# EAGLE design adc_microboard (EAGLE 6.3)

## Sheet 1 of 2
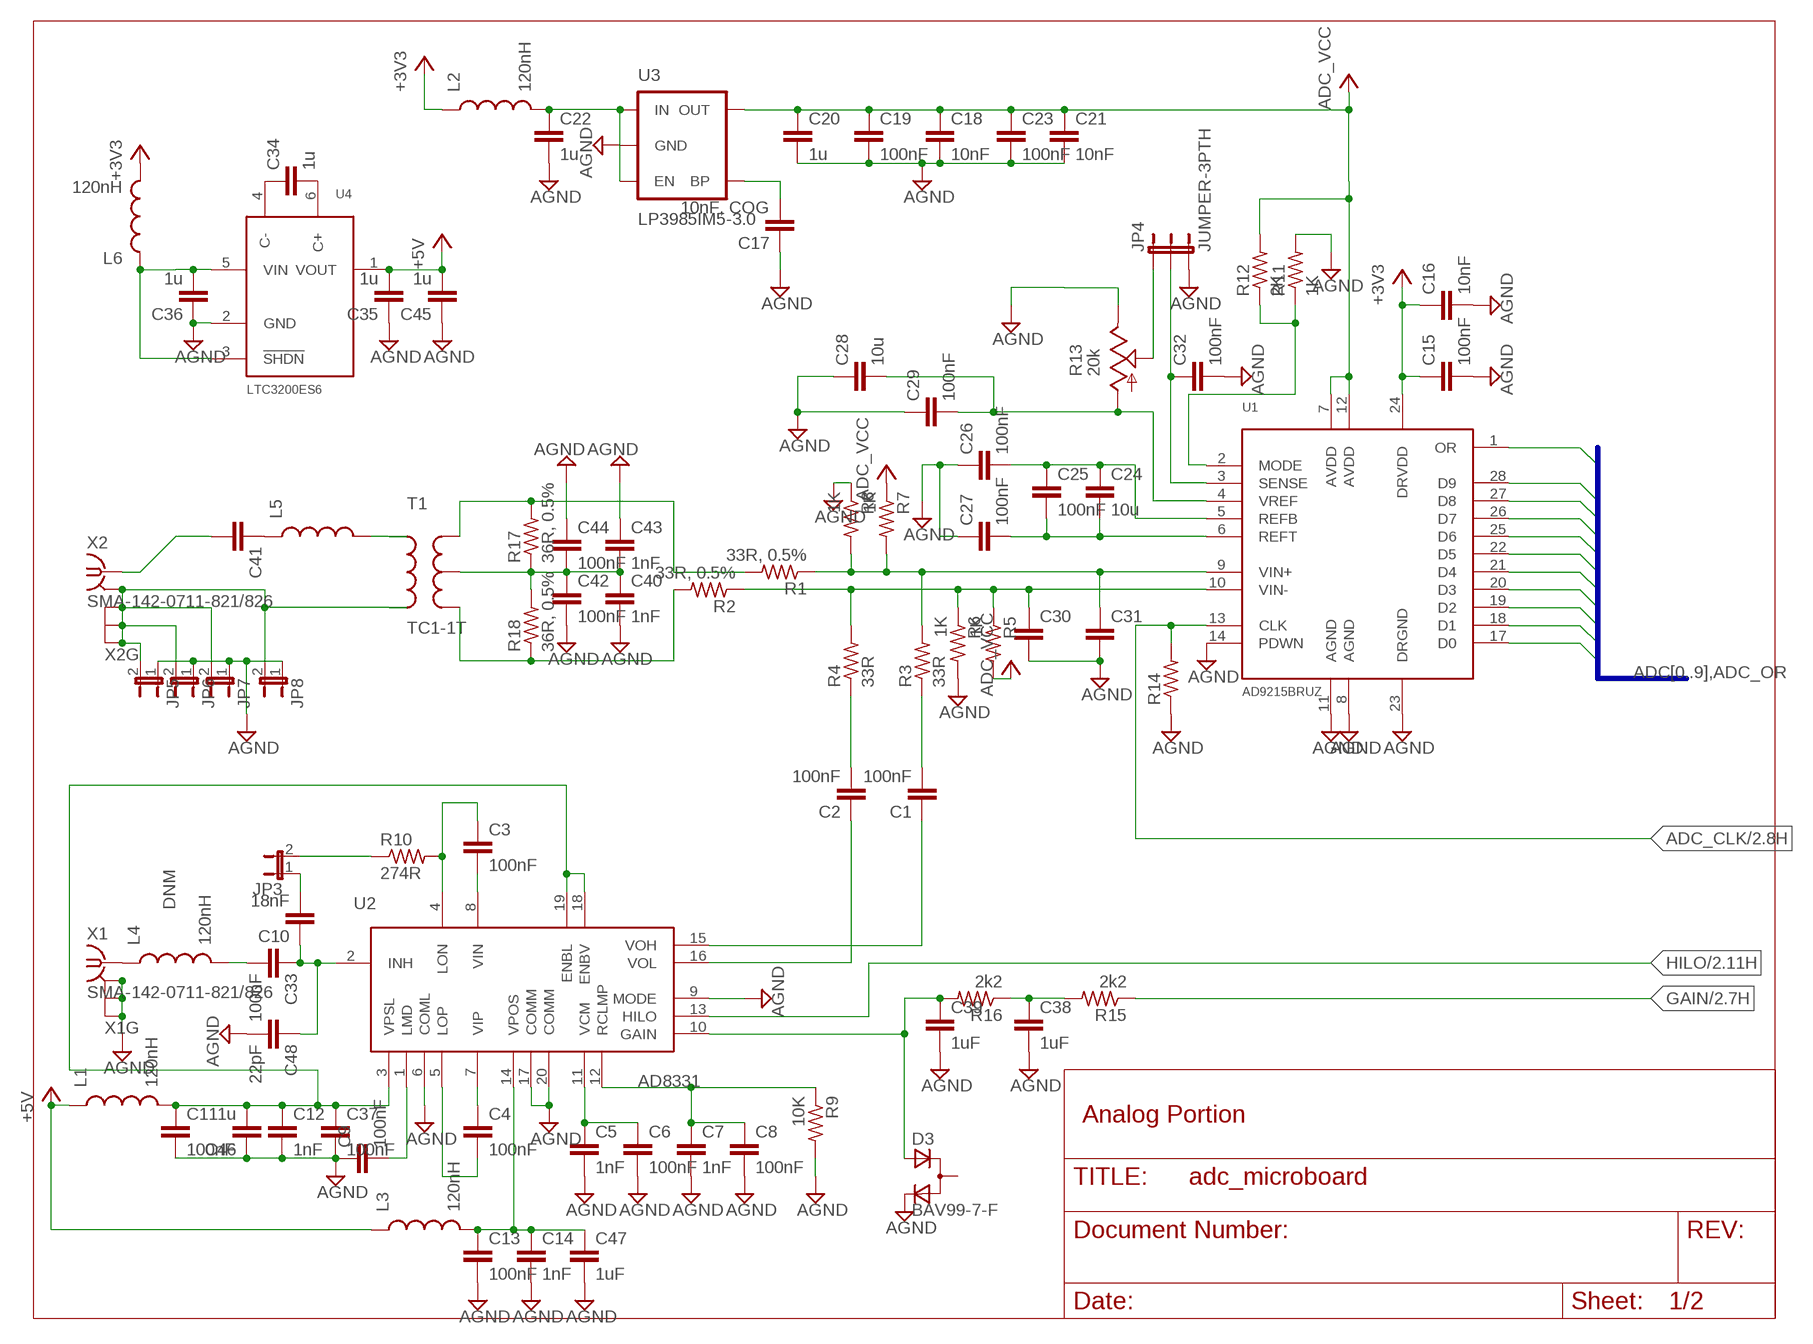
[diagram p0: schematic, sheet 1]

### Parts
C1  100nF  C-EUC0603K  [C0603K]
C2  100nF  C-EUC0603K  [C0603K]
C3  100nF  C-EUC0402  [C0402]
C4  100nF  C-EUC0402  [C0402]
C5  1nF  C-EUC0402  [C0402]
C6  100nF  C-EUC0402  [C0402]
C7  1nF  C-EUC0402  [C0402]
C8  100nF  C-EUC0402  [C0402]
C9  100nF  C-EUC0402  [C0402]
C10  18nF  C-EUC0603  [C0603]
C11  100nF  C-EUC0402  [C0402]
C12  1nF  C-EUC0402  [C0402]
C13  100nF  C-EUC0402  [C0402]
C14  1nF  C-EUC0402  [C0402]
C15  100nF  C-EUC0402  [C0402]
C16  10nF  C-EUC0402  [C0402]
C17  10nF, COG  C-EUC0402  [C0402]
C18  10nF  C-EUC0402  [C0402]
C19  100nF  C-EUC0402  [C0402]
C20  1u  C-EUC0603  [C0603]
C21  10nF  C-EUC0402  [C0402]
C22  1u  C-EUC0603  [C0603]
C23  100nF  C-EUC0402  [C0402]
C24  10u  C-EUC0603  [C0603]
C25  100nF  C-EUC0402  [C0402]
C26  100nF  C-EUC0402  [C0402]
C27  100nF  C-EUC0402  [C0402]
C28  10u  C-EUC0603  [C0603]
C29  100nF  C-EUC0402  [C0402]
C30  C-EUC0402  [C0402]
C31  C-EUC0402  [C0402]
C32  100nF  C-EUC0402  [C0402]
C33  100nF  C-EUC0603K  [C0603K]
C34  1u  C-EUC0603  [C0603]
C35  1u  C-EUC0603  [C0603]
C36  1u  C-EUC0603  [C0603]
C37  100nF  C-EUC0402  [C0402]
C38  1uF  C-EUC0603  [C0603]
C39  1uF  C-EUC0603  [C0603]
C40  1nF  C-EUC0402  [C0402]
C41  C-EUC0603K  [C0603K]
C42  100nF  C-EUC0402  [C0402]
C43  1nF  C-EUC0402  [C0402]
C44  100nF  C-EUC0402  [C0402]
C45  1u  C-EUC0603  [C0603]
C46  1u  C-EUC0402  [C0402]
C47  1uF  C-EUC0402  [C0402]
C48  22pF  C-EUC0603  [C0603]
D3  BAV99-7-F  D_ACACSOT23  [SOT-23]
JP3  JUMPER-2SMD-NC  [SJ_2S]
JP4  JUMPER-3PTH  [1X03]
JP5  JUMPER-2SMD-NC  [SJ_2S]
JP6  JUMPER-2SMD-NC  [SJ_2S]
JP7  JUMPER-2SMD-NC  [SJ_2S]
JP8  JUMPER-2SMD-NC  [SJ_2S]
L1  120nH  INDUCTOR0603  [0603]
L2  120nH  INDUCTOR0603  [0603]
L3  120nH  INDUCTOR0603  [0603]
L4  120nH  INDUCTOR0603  [0603]
L5  INDUCTOR0603  [0603]
L6  120nH  INDUCTOR0603  [0603]
R1  33R, 0.5%  R-US_R0603  [R0603]
R2  33R, 0.5%  R-US_R0603  [R0603]
R3  33R  R-US_R0603  [R0603]
R4  33R  R-US_R0603  [R0603]
R5  1K  R-US_R0402  [R0402]
R6  1K  R-US_R0402  [R0402]
R7  1K  R-US_R0402  [R0402]
R8  1K  R-US_R0402  [R0402]
R9  10K  R-US_R0603  [R0603]
R10  274R  R-US_R0603  [R0603]
R11  1K  R-US_R0402  [R0402]
R12  2K  R-US_R0603  [R0603]
R13  20k  TRIM_US-3361P  [3361P]
R14  R-US_R0603  [R0603]
R15  2k2  R-US_R0603  [R0603]
R16  2k2  R-US_R0603  [R0603]
R17  36R, 0.5%  R-US_R0603  [R0603]
R18  36R, 0.5%  R-US_R0603  [R0603]
T1  TC1-1T  [AT224-1A]
U1  AD9215BRUZ  [TSSOP28]
U2  AD8331  [QSOP20]
U3  LP3985IM5-3.0  V_REG_LDOSMD  [SOT23-5]
U4  LTC3200ES6  [SOT23-6L]
X1  SMA-142-0711-821/826  [J502-ND-142-0711-821/826]
X2  SMA-142-0711-821/826  [J502-ND-142-0711-821/826]

### Nets
+3V3: C15.1 C16.1 L2.1 L6.2 U1.24(DRVDD) ; also sheet 2
+5V: C35.2 C45.2 L1.1 L3.1 U4.1(VOUT)
ADC0: U1.17(D0) ; also sheet 2
ADC1: U1.18(D1) ; also sheet 2
ADC2: U1.19(D2) ; also sheet 2
ADC3: U1.20(D3) ; also sheet 2
ADC4: U1.21(D4) ; also sheet 2
ADC5: U1.22(D5) ; also sheet 2
ADC6: U1.25(D6) ; also sheet 2
ADC7: U1.26(D7) ; also sheet 2
ADC8: U1.27(D8) ; also sheet 2
ADC9: U1.28(D9) ; also sheet 2
ADC_CLK: R14.2 U1.13(CLK) ; also sheet 2
ADC_OR: U1.1(OR) ; also sheet 2
ADC_VCC: C18.1 C19.1 C20.1 C21.1 C23.1 R5.2 R7.1 R12.2 U1.7(AVDD) U1.12(AVDD) U3.5(OUT)
AGND: C5.2 C6.2 C7.2 C8.2 C9.1 C11.2 C12.2 C13.2 C14.2 C15.2 C16.2 C17.1 C18.2 C19.2 C20.2 C21.2 C22.2 C23.2 C26.1 C27.1 C28.1 C29.1 C30.2 C31.2 C32.2 C35.1 C36.1 C37.2 C38.2 C39.2 C40.2 C42.2 C43.1 C44.1 C45.1 C46.1 C47.2 C48.2 D3.2(C) JP4.3 JP5.1 JP6.1 JP7.1 JP8.1 R6.2 R8.1 R9.2 R11.2 R13.1(E) R14.1 U1.8(AGND) U1.11(AGND) U1.14(PDWN) U1.23(DRGND) U2.6(COML) U2.9(MODE) U2.17(COMM) U2.20(COMM) U3.2(GND) U4.2(GND) X1.G@1(GND) X1.G@2(GND) X1.G@3(GND) X1.G@4(GND) ; also sheet 2
GAIN: R15.1 ; also sheet 2
HILO: U2.13(HILO) ; also sheet 2
N$1: C31.1 R1.1 R3.2 R7.2 R8.2 U1.9(VIN+)
N$2: JP4.1 R13.2(S)
N$3: C1.2 R3.1
N$4: C2.2 R4.1
N$5: C4.2 U2.5(LOP)
N$6: C2.1 U2.16(VOL)
N$7: C1.1 U2.15(VOH)
N$8: C4.1 U2.7(VIP)
N$9: C3.2 U2.8(VIN)
N$10: C3.1 R10.2 U2.4(LON)
N$11: C5.1 C6.1 U2.11(VCM)
N$12: C7.1 C8.1 R9.1 U2.12(RCLMP)
N$13: C9.2 U2.1(LMD)
N$14: C10.2 JP3.1
N$15: JP3.2 R10.1
N$16: C10.1 C33.1 C48.1 U2.2(INH)
N$17: C17.2 U3.4(BP)
N$19: L4.1 X1.1
N$20: C13.1 C14.1 C47.1 L3.2 U2.14(VPOS)
N$21: C22.1 L2.2 U3.1(IN) U3.3(EN)
N$23: C24.1 C25.1 C26.2 U1.5(REFB)
N$24: C41.1 L5.1
N$25: C24.2 C25.2 C27.2 U1.6(REFT)
N$26: C30.1 R2.1 R4.2 R5.1 R6.1 U1.10(VIN-)
N$27: C28.2 C29.2 R13.3(A) U1.4(VREF)
N$28: C32.1 JP4.2 U1.3(SENSE)
N$29: R11.1 R12.1 U1.2(MODE)
N$30: L5.2 T1.6(P1)
N$31: JP5.2 JP6.2 JP7.2 JP8.2 T1.4(P2) X2.G@1(GND) X2.G@2(GND) X2.G@3(GND) X2.G@4(GND)
N$32: R1.2 R17.2 T1.1(S1)
N$33: C34.1 U4.4(C-)
N$34: C34.2 U4.6(C+)
N$35: C11.1 C12.1 C37.1 C46.2 L1.2 U2.3(VPSL) U2.18(ENBV) U2.19(ENBL)
N$36: C38.1 R15.2 R16.1
N$37: C39.1 D3.3(A) R16.2 U2.10(GAIN)
N$38: R2.2 R18.1 T1.3(S2)
N$39: C40.1 C42.1 C43.2 C44.2 R17.1 R18.2 T1.2(ST)
N$43: C41.2 X2.1
N$45: C36.2 L6.1 U4.3(!SHDN) U4.5(VIN)
N$46: C33.2 L4.2
Unconnected: D3.1(CA)

### Buses
ADC[0..9],ADC_OR

### Notes on the sheet
- DNM
- Analog Portion

## Sheet 2 of 2
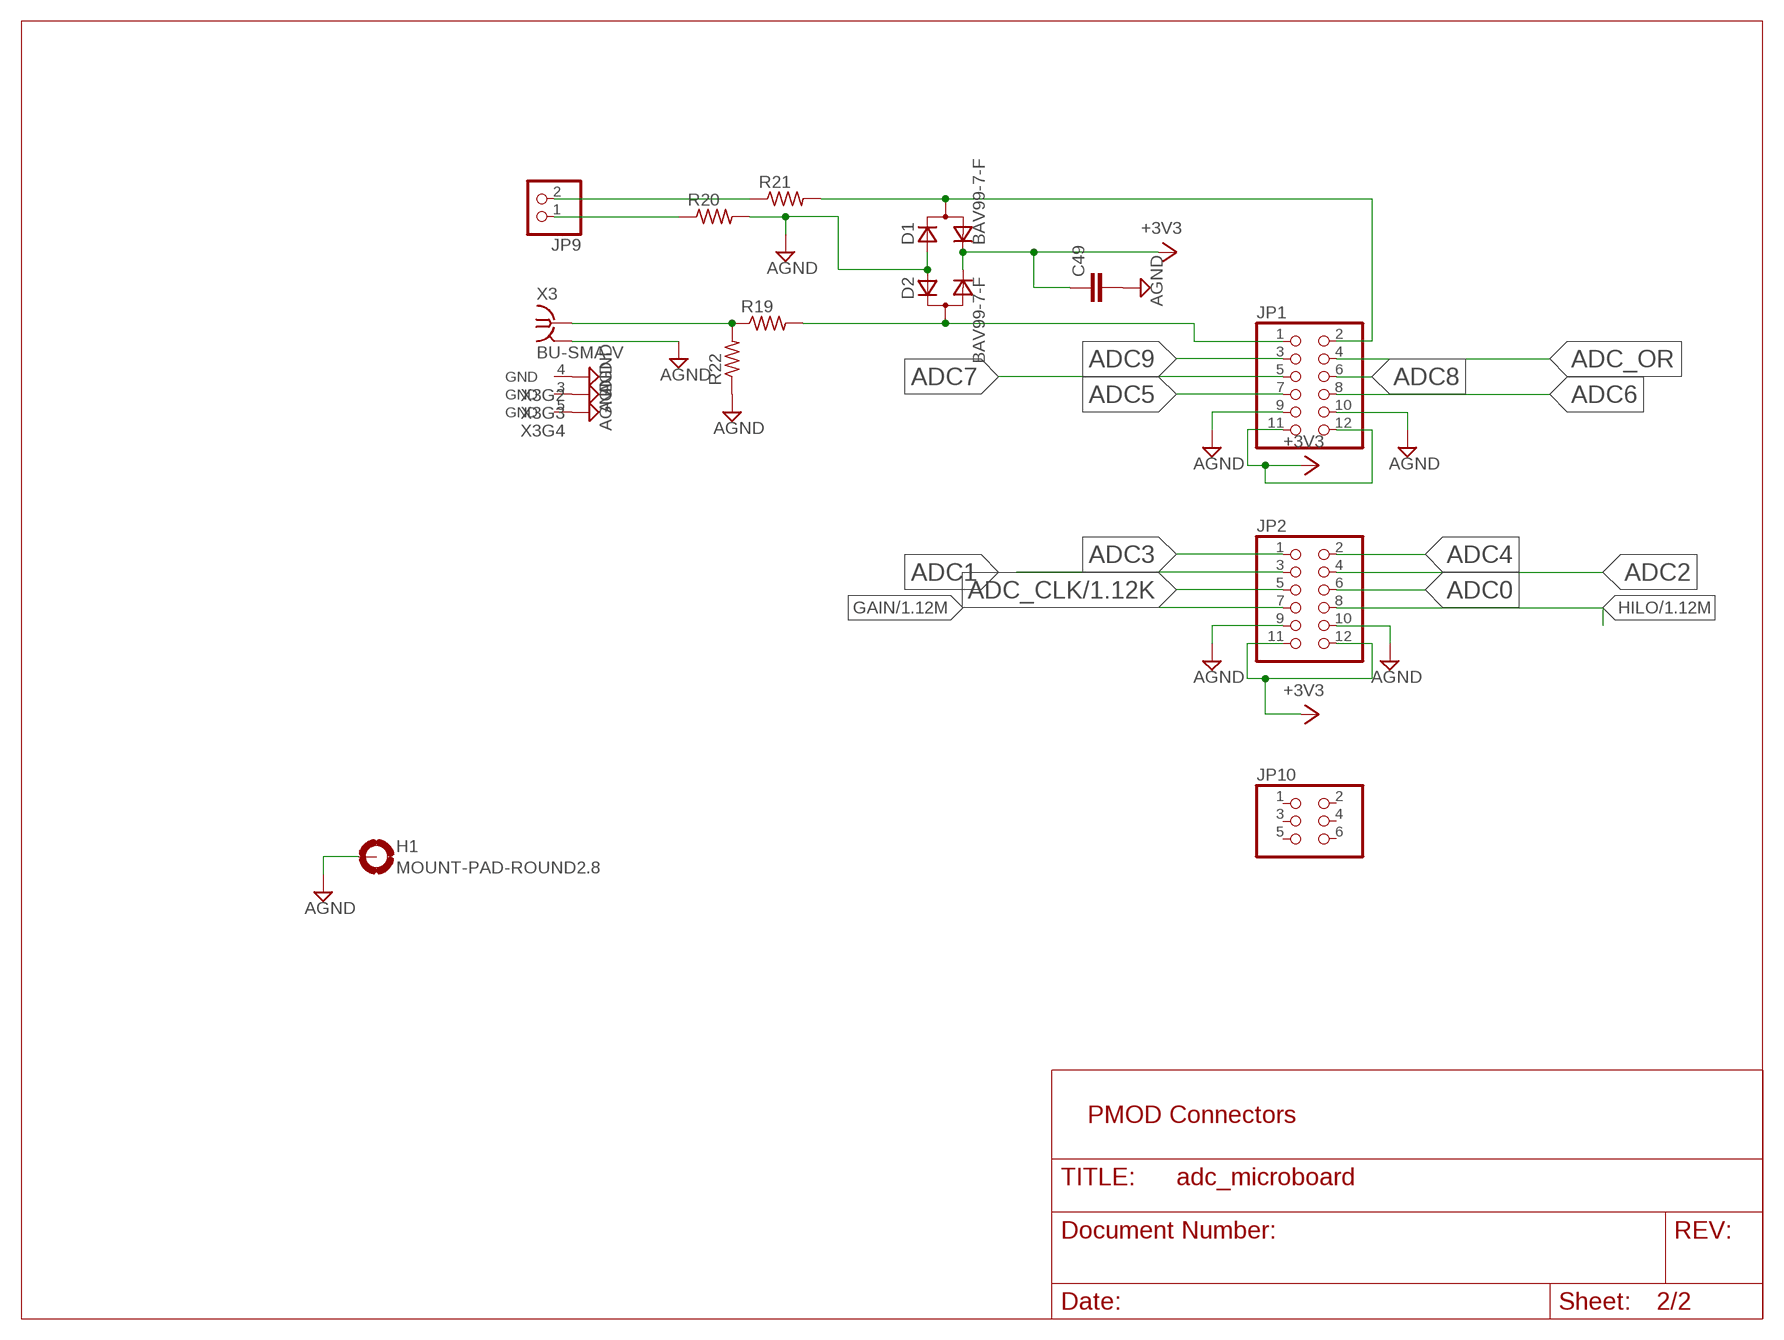
[diagram p1: schematic, sheet 2]

### Parts
C49  C-EUC0603  [C0603]
D1  BAV99-7-F  D_ACACSOT23  [SOT-23]
D2  BAV99-7-F  D_ACACSOT23  [SOT-23]
H1  MOUNT-PAD-ROUND2.8  [2,8-PAD]
JP1  PINHD-2X6  [2X06]
JP2  PINHD-2X6  [2X06]
JP9  PINHD-1X2/90  [1X02/90]
JP10  PINHD-2X3  [2X03]
R19  R-US_R0805  [R0805]
R20  R-US_R0603  [R0603]
R21  R-US_R0603  [R0603]
R22  R-US_R0603  [R0603]
X3  BU-SMA-V  [BU-SMA-V]

### Nets
+3V3: C49.1 D1.2(C) D2.2(C) JP1.11 JP1.12 JP2.11 JP2.12 ; also sheet 1
ADC0: JP2.6 ; also sheet 1
ADC1: JP2.3 ; also sheet 1
ADC2: JP2.4 ; also sheet 1
ADC3: JP2.1 ; also sheet 1
ADC4: JP2.2 ; also sheet 1
ADC5: JP1.7 ; also sheet 1
ADC6: JP1.8 ; also sheet 1
ADC7: JP1.5 ; also sheet 1
ADC8: JP1.6 ; also sheet 1
ADC9: JP1.3 ; also sheet 1
ADC_CLK: JP2.5 ; also sheet 1
ADC_OR: JP1.4 ; also sheet 1
AGND: C49.2 D1.3(A) D2.3(A) H1.B2,8(MOUNT) JP1.9 JP1.10 JP2.9 JP2.10 R20.2 R22.1 X3.2(GND) X3.3(GND) X3.4(GND) X3.5(GND) ; also sheet 1
GAIN: JP2.7 ; also sheet 1
HILO: JP2.8 ; also sheet 1
N$18: D2.1(CA) JP1.1 R19.2
N$40: R19.1 R22.2 X3.1
N$41: JP9.1 R20.1
N$42: JP9.2 R21.1
N$44: D1.1(CA) JP1.2 R21.2
Unconnected: JP10.1 JP10.2 JP10.3 JP10.4 JP10.5 JP10.6

### Notes on the sheet
- PMOD Connectors

## Library data of the parts
C1-C4 C28 C30 C31 C33 C38 C39 C41 = rcl:C-EU: CAPACITOR, European symbol
C5 C7 C12 C14 C40 C43 C47 = rcl:C-EU: CAPACITOR, European symbol; DIGIKEY#: 445-4924-1-ND; PART#: C1005X7R1E102K
C6 C8 C9 C11 C13 C15 C19 C23 C25-C27 C29 C32 C37 C42 C44 = rcl:C-EU: CAPACITOR, European symbol; DIGIKEY#: 490-1318-1-ND; PART#: GRM155R61A104KA01D
C10 C48 = rcl:C-EU: CAPACITOR, European symbol; DIGIKEY#: 587-1099-1-ND; MANF#: LMK107SD183JA-T
C16 = rcl:C-EU: CAPACITOR, European symbol; DIGIKEY#: 490-1312-1-ND; MANF#: GRM155R71E103KA01D
C17 = rcl:C-EU: CAPACITOR, European symbol; DIGIKEY#: 445-2664-1-ND
C18 C21 = rcl:C-EU: CAPACITOR, European symbol; DIGIKEY#: 490-1312-1-ND; DIIGKEY#: 490-1312-1-ND; MANF#: GRM155R71E103KA01D; PART#: GRM155R71E103KA01D
C20 C22 C34-C36 C45 C46 = rcl:C-EU: CAPACITOR, European symbol; DIGIKEY#: 490-1543-1-ND; PART#: GRM188R61A105KA61D
C24 = rcl:C-EU: CAPACITOR, European symbol; DIGIKEY#: C1608X5R0J106K
C49 = adc_microboard:C-EU: CAPACITOR, European symbol
D1-D3 = zetex:D_ACAC: Dual DIODE; OC_FARNELL: unknown; OC_NEWARK: unknown
H1 = holes:MOUNT-PAD-ROUND: MOUNTING PAD, round
JP1 = pinhead:PINHD-2X6: PIN HEADER; DIGIKEY#: 609-3373-ND
JP2 = pinhead:PINHD-2X6: PIN HEADER
JP3 JP5-JP8 = SparkFun:JUMPER-2: Jumper Basic 0.1" spaced jumper. Use with breakaway headers.
JP4 = SparkFun:JUMPER-3
JP9 = pinhead:PINHD-1X2: PIN HEADER; DIGIKEY#: WM2711-ND
JP10 = pinhead:PINHD-2X3: PIN HEADER
L1 = SparkFun:INDUCTOR: Inductors Basic Inductor/Choke - 0603 and 1206. Footprints are not proven and vary greatly between part numbers.; DIGIKEY#: 445-6234-1-ND; PART#: MLF1608DR12M
L2-L6 = SparkFun:INDUCTOR: Inductors Basic Inductor/Choke - 0603 and 1206. Footprints are not proven and vary greatly between part numbers.
R1 = adafruit:R-US_: RESISTOR, American symbol; DIGIKEY#: RR08Q33DCT-ND
R2-R4 R6-R9 R11 R12 R14-R16 R19-R22 = adafruit:R-US_: RESISTOR, American symbol
R5 = adafruit:R-US_: RESISTOR, American symbol; DIGIKEY#: RHM1.00KCDCT-ND
R10 = adafruit:R-US_: RESISTOR, American symbol; DIGIKEY#: RR08P274DCT-ND
R13 = customs:TRIM_US-: POTENTIOMETER; DIGIKEY#: 3361P-203GLFCT-ND; PART#: 3361P-1-203GLF
R17 R18 = adafruit:R-US_: RESISTOR, American symbol; DIGIKEY#: RR08Q36DCT-ND
T1 = customs:TC1-1T
U1 = customs:AD9215BRUZ; DIGIKEY#: AD9215BRUZ-105-ND
U2 = customs:AD8331; DIGIKEY#: AD8331ARQZ-ND; PART#: AD8331ARQZ
U3 = SparkFun:V_REG_LDO: Voltage Regulator LDO Standard 150mA LDO voltage regulator in SOT-23 layout. Micrel part MIC5205. BP (by-pass) pin is used to lower output noise with 470pF cap.; DIGIKEY#: LP3985IM5-3.0CT-ND
U4 = customs:LTC3200; DIIGKEY#: LTC3200ES6-5#TRMPBFCT-ND; PART#: LTC3200ES6-5#TRMPBF
X1 X2 = con-coax:SMA-: SMA 50 Ohm End Launch Jack Receptacle - Round Contact Johnson Components Source: www.johnsoncomponents.com .. J502-ND.pdf; DIGIKEY#: CONSMA003.062-ND; MF: JOHNSON COMPONENTS; MPN: 142-0711-821; OC_FARNELL: 1019328; OC_NEWARK: 16F3627
X3 = con-coax:BU-SMA-V: FEMALE SMA CONNECTOR Radiall distributor RS 112-3794; OC_FARNELL: unknown; OC_NEWARK: unknown

## Board
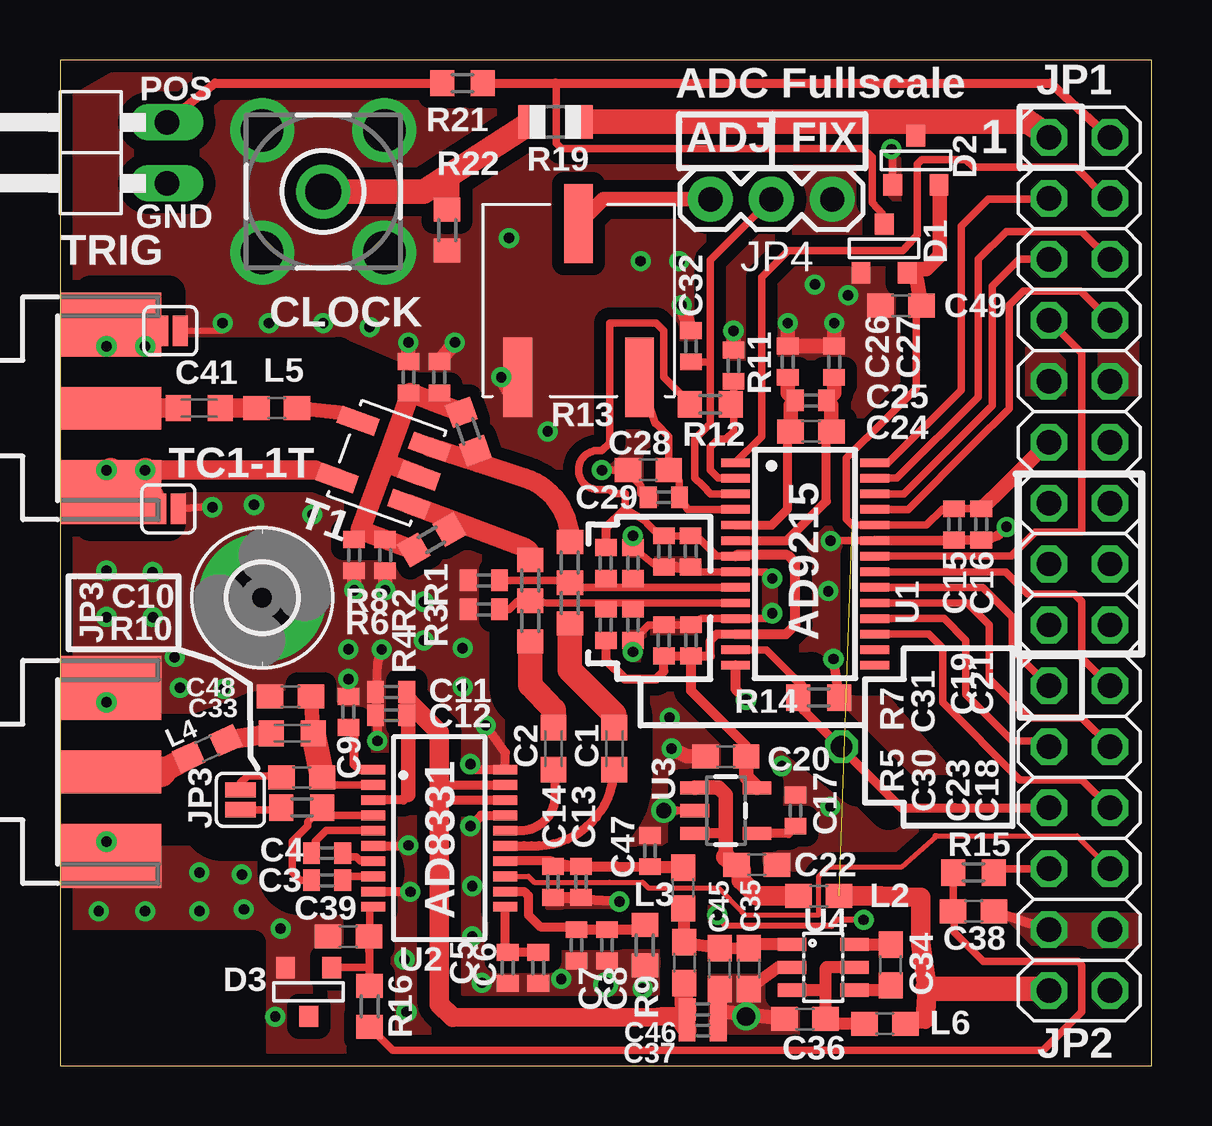
[diagram p2: board, top side]
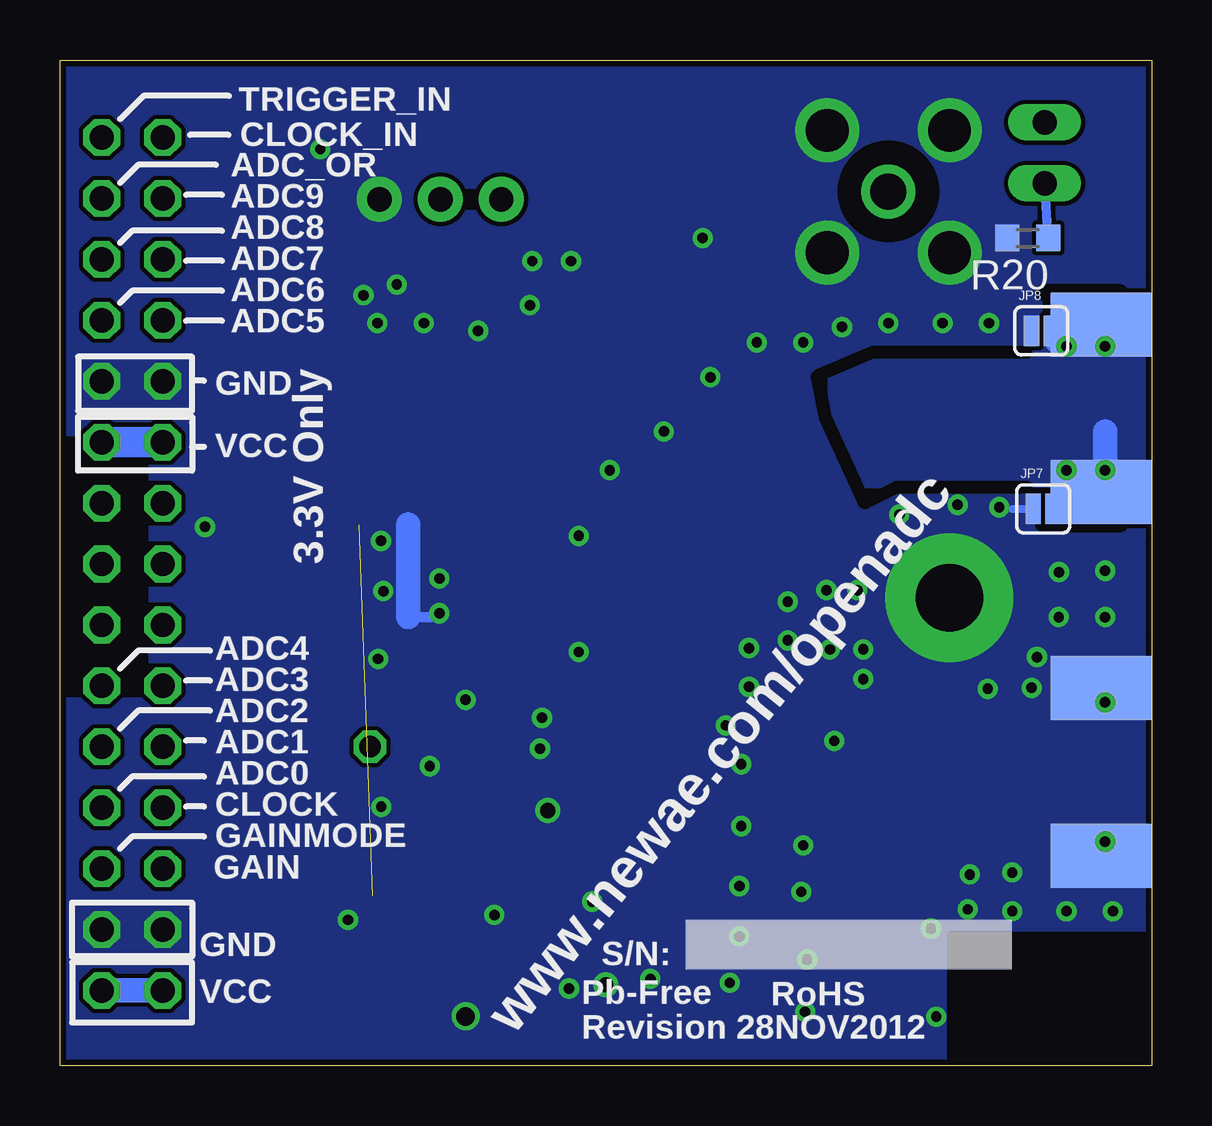
[diagram p3: board, bottom side, seen from below]

Size 45.48 x 41.94 mm. Coordinates in mm from the lower left corner, seen from the top.
Outline: 0,0 45.48,0 45.48,41.94 0,41.94 0,0
Copper layers (1*16): Top 0.035mm / dielectric 1.5mm / Bottom 0.035mm
Design rules "default": minimum track width 7mil, minimum drill 24mil, track to track 7mil, track to pad 7mil, pad to pad 7mil, via to via 7mil, smd to smd 0mil, copper to edge 10mil, drill to drill 8mil, minimum pad ring 10mil, minimum via ring 8mil, stop-mask expansion 4mil, vias tented up to drill 26mil, thermal gap 10mil
tRestrict: area -0.3,-0.6 to 8.1,5.2; 49 lines
bRestrict: area 10.2,35.7 to 11.7,37.2; area -0.3,-0.3 to 8.4,5.5; area 41.9,15.5 to 45.5,26.1; 8 lines

### Footprints (pad centres in the part's own frame; a part is rotated, then mirrored left to right if it is on the bottom)
C0603K = smd 1.05 x 1.08: 1 -0.875,0; 2 0.875,0
C0402 = smd 0.7 x 0.9: 1 -0.65,0; 2 0.65,0
C0603 = smd 1.1 x 1: 1 -0.85,0; 2 0.85,0
SOT-23 = smd 0.787 x 0.889: 1 0.025,-1.016; 2 -0.94,1.016; 3 0.991,1.016
2,8-PAD = drill 2.8 pad 5.334: B2,8 0,0
2X06 = drill 1.016 octagon: 1 -6.35,-1.27; 2 -6.35,1.27; 3 -3.81,-1.27; 4 -3.81,1.27; 5 -1.27,-1.27; 6 -1.27,1.27; 7 1.27,-1.27; 8 1.27,1.27; 9 3.81,-1.27; 10 3.81,1.27; 11 6.35,-1.27; 12 6.35,1.27
SJ_2S = smd 0.635 x 1.27: 1 -0.412,0; 2 0.412,0
1X03 = drill 1.016 pad 1.88: 1 0,0; 2 2.54,0; 3 5.08,0
1X02/90 = drill 1.016 long: 1 -1.27,-3.81; 2 1.27,-3.81
2X03 = drill 1.016 octagon: 1 -2.54,-1.27; 2 -2.54,1.27; 3 0,-1.27; 4 0,1.27; 5 2.54,-1.27; 6 2.54,1.27
0603 = smd 1.1 x 1: 1 -0.85,0; 2 0.85,0
R0603 = smd 1 x 1.1: 1 -0.85,0; 2 0.85,0
R0402 = smd 0.7 x 0.9: 1 -0.65,0; 2 0.65,0
3361P = smd 1.19 x 3.3: 1 -2.54,0; 2 0,6.4; 3 2.54,0
R0805 = smd 1.1 x 1.4: 1 -1,0; 2 1,0
AT224-1A = smd 0.762 x 1.651: 1 -1.27,2.54; 2 0,2.54; 3 1.27,2.54; 4 1.27,-0.635; 6 -1.27,-0.635
TSSOP28 = smd 0.35 x 1.2: 1 -4.225,-2.9; 2 -3.575,-2.9; 3 -2.925,-2.9; 4 -2.275,-2.9; 5 -1.625,-2.9; 6 -0.975,-2.9; 7 -0.325,-2.9; 8 0.325,-2.9; 9 0.975,-2.9; 10 1.625,-2.9; 11 2.275,-2.9; 12 2.925,-2.9; 13 3.575,-2.9; 14 4.225,-2.9; 15 4.225,2.9; 16 3.575,2.9; 17 2.925,2.9; 18 2.275,2.9; 19 1.625,2.9; 20 0.975,2.9; 21 0.325,2.9; 22 -0.325,2.9; 23 -0.975,2.9; 24 -1.625,2.9; 25 -2.275,2.9; 26 -2.925,2.9; 27 -3.575,2.9; 28 -4.225,2.9
QSOP20 = smd 0.4 x 1: 1 -2.858,-2.75; 2 -2.223,-2.75; 3 -1.588,-2.75; 4 -0.953,-2.75; 5 -0.318,-2.75; 6 0.318,-2.75; 7 0.953,-2.75; 8 1.588,-2.75; 9 2.223,-2.75; 10 2.858,-2.75; 11 2.858,2.75; 12 2.223,2.75; 13 1.588,2.75; 14 0.953,2.75; 15 0.318,2.75; 16 -0.318,2.75; 17 -0.953,2.75; 18 -1.588,2.75; 19 -2.223,2.75; 20 -2.858,2.75
SOT23-5 = smd 0.55 x 1.2: 1 -0.95,-1.3; 2 0,-1.3; 3 0.95,-1.3; 4 0.95,1.3; 5 -0.95,1.3
SOT23-6L = smd 0.55 x 1.2: 1 -0.95,-1.3; 2 0,-1.3; 3 0.95,-1.3; 4 0.95,1.3; 5 0,1.3; 6 -0.95,1.3
J502-ND-142-0711-821/826 = smd 4.191 x 1.778: 1 2.115,0 | smd 4.191 x 2.667: G@1 2.115,3.495; G@2 2.115,-3.495 | smd 4.191 x 2.667 bottom: G@3 2.115,3.495; G@4 2.115,-3.495
BU-SMA-V = drill 1.499: 1 0,0 | drill 1.778: 2 -2.55,2.55; 3 2.55,2.55; 4 2.55,-2.55; 5 -2.55,-2.55

### Placement (x,y rotation side)
C1  23.1,13.23 90 top
C2  20.56,13.23 90 top
C3  11.13,7.74 0 top
C4  11.13,8.87 180 top
C5  18.66,4.09 270 top
C6  19.93,4.09 270 top
C7  21.52,5.04 270 top
C8  22.79,5.04 270 top
C9  12.01,14.76 270 top
C10  10.08,12.03 180 top
C11  13.8,15.59 180 top
C12  13.8,14.63 180 top
C13  21.71,7.67 270 top
C14  20.54,7.67 270 top
C15  37.26,22.58 270 top
C16  38.39,22.58 270 top
C17  30.65,10.65 270 top
C18  26.29,17.74 90 top
C19  25.17,21.45 270 top
C20  27.74,12.9 180 top
C21  26.28,21.45 270 top
C22  29.03,8.39 0 top
C23  25.16,17.74 90 top
C24  31.29,26.45 0 top
C25  31.29,27.74 0 top
C26  30.32,29.35 270 top
C27  32.26,29.35 270 top
C28  24.52,24.84 0 top
C29  25.16,23.71 0 top
C30  23.87,18.39 270 top
C31  23.87,20.97 90 top
C32  26.29,30 90 top
C33  9.68,13.87 180 top
C34  34.6,4.21 90 top
C35  28.71,4.06 90 top
C36  31.04,1.96 0 top
C37  26.78,1.48 0 top
C38  38.06,6.45 0 top
C39  12.02,5.4 180 top
C40  14.52,28.71 90 top
C41  5.81,27.42 180 top
C42  15.81,28.71 90 top
C43  12.26,21.29 90 top
C44  13.55,21.29 90 top
C45  27.49,4.06 90 top
C46  26.78,2.36 180 top
C47  24.58,8.96 90 top
C48  9.6,15.4 180 top
C49  35.04,31.69 180 top
D1  34.36,34.08 180 top
D2  35.68,37.75 180 top
D3  10.33,3.09 0 top
H1  8.42,19.52 0 top
JP1  42.47,32.35 270 top
JP2  42.47,9.49 270 top
JP3  7.52,11.1 270 top
JP4  27.1,36.13 0 top
JP5  4.6,30.65 180 top
JP6  4.52,23.23 180 top
JP7  4.52,23.23 0 bottom
JP8  4.6,30.64 0 bottom
JP9  0.65,38.06 90 top
JP10  42.47,20.92 90 top
L1  26.02,4.31 270 top
L2  31.61,7.1 180 top
L3  25.97,7.42 90 top
L4  6.13,13.23 24.4 top
L5  9.03,27.42 0 top
L6  34.37,1.76 0 top
R1  21.25,20.98 90 top
R2  19.59,20.24 90 top
R3  21.25,19.3 90 top
R4  19.59,18.55 90 top
R5  22.74,18.39 270 top
R6  17.66,19.03 180 top
R7  22.74,20.97 270 top
R8  17.66,20.24 0 top
R9  24.37,5.04 270 top
R10  10.08,10.77 0 top
R11  28.06,29.19 90 top
R12  27.1,27.58 180 top
R13  21.61,28.71 0 top
R14  31.61,15.35 180 top
R15  38.06,8.06 180 top
R16  12.9,2.49 90 top
R17  17.02,26.45 290 top
R18  15.48,21.94 210 top
R19  20.65,39.35 0 top
R20  5.16,34.52 180 bottom
R21  16.77,40.97 0 top
R22  16.13,34.84 90 top
T1  12.58,25.48 250 top
U1  31.04,20.92 270 top
U2  15.8,9.49 270 top
U3  27.74,10.65 270 top
U4  31.8,4.12 270 top
X1  0,12.26 0 top
X2  0,27.42 0 top
X3  10.97,36.45 0 top

### Tracks (layer width: path | path; a pad name or v marks a point on that pad's centre or on a via)
+3V3  (1 unrouted)
  Top 0.305: C16.1 C15.1 37.41,23.23 36.77,23.23 36.1,22.55 U1.24 33.01,22.55 32.75,22.8 32.75,25.35 33.59,26.19 33.62,26.19 35.33,27.89 35.59,28.15 35.68,28.25 35.68,31.69 C49.1 | 35.33,33.13 D1.2 35.73,33.22 | 36.49,36.6 D2.2
  Top 0.508: 36.06,1.96 36.06,1.79 L6.2
  Top 0.61: C16.1 39.03,23.83 JP1.11 | C49.1 35.69,32.77 D1.2 | 35.73,33.22 36.09,33.22 36.65,33.79 36.65,36.71 D2.2
  Top 0.813: 36.06,1.96 36.13,3.23 35.86,5.09 35.86,7.03 34.19,7.1 L2.1
  Top 1.016: 36.13,3.23 41.12,3.23 JP2.11
  Bottom 1.016: JP2.11 JP2.12
  Bottom 1.27: JP1.11 JP1.12
+5V
  Top 0.508: U4.1 28.72,5.07 C35.2 27.61,4.89 C45.2 26.06,5.11 L1.1 26.02,6.52 L3.1
ADC0
  Top 0.305: JP2.6 42.58,11.94 40,11.94 36.77,15.16 36.77,17.42 36.19,18 U1.17
ADC1
  Top 0.305: U1.18 36.83,18.65 37.74,17.74 37.74,15.48 39.68,13.55 40.96,13.55 JP2.3
ADC2
  Top 0.305: JP2.4 43.74,13.35 42.58,14.52 40.64,14.52 40.32,14.52 38.71,16.13 38.71,18.39 38.06,19.03 | 38.06,19.03 | U1.19 37.8,19.3 38.06,19.03
ADC3
  Top 0.305: U1.20 38.44,19.95 39.68,18.71 39.68,17.37 JP2.1
ADC4
  Top 0.305: U1.21 39.4,20.6 40.32,19.68 42.26,19.68 42.58,19.35 42.58,17.01 JP2.2
ADC5
  Top 0.305: U1.22 39.64,21.25 40.64,22.26 42.58,22.26 42.58,29.71 JP1.7
ADC6
  Top 0.305: U1.25 35.34,23.2 38.04,25.9 39.55,27.41 39.55,31.73 40.13,32.31 42.52,32.31 JP1.8
ADC7
  Top 0.305: U1.26 35.15,23.85 38.84,27.54 38.84,32.5 39.97,33.63 JP1.5
ADC8
  Top 0.305: U1.27 34.87,24.5 38.26,27.89 38.26,33.63 39.42,34.79 42.58,34.79 JP1.6
ADC9
  Top 0.305: U1.28 34.52,25.15 37.55,28.18 37.55,35.01 38.68,36.14 41.18,36.14 JP1.3
ADC_CLK  (via drill 0.9)
  Top 0.254: v32.57,13.3 32.57,13.24 32.94,12.87
  Top 0.305: U1.13 29.42,17.35 30.64,16.13
  Top 0.381: JP2.5 37.3,10.76 35.04,10.76 32.94,12.87 30.97,14.84 30.97,15.48 R14.2 30.96,15.81 30.64,16.13
ADC_OR
  Top 0.305: JP1.4 43.62,36.16 42.32,37.46 38.07,37.46 37.75,37.78 35.91,37.78 35.72,37.59 35.72,34.63 35.23,34.14 35.23,34.11 35.1,33.98 30.34,33.98 29.24,32.89 29.24,26.25 U1.1
ADC_VCC
  Top 0.305: U1.7 27.3,21.25 27.3,21.33 26.53,22.1 C19.1 | C19.1 25.16,22.1 C19.1 | C19.1 C21.1 24.99,22.1 24.52,22.58 24.35,22.74 23.55,23.23 23.55,23.87 23.06,23.87 22.9,24.03 22.42,24.03 arc-191 22.58,25.65 22.9,25.97 22.9,30.97 24.84,30.97 25.16,30.65 25.16,28.71 26.25,27.62 R12.2 26.13,27.38
  Top 0.381: U1.12 27.35,18 27.1,17.74 27.1,17.09 C18.1 C23.1 | C23.1 | R7.1 22.74,22.42 23.55,23.23 | R5.2 22.74,16.94 23.55,16.13 24.84,16.13 25.16,16.45 C23.1
  Top 0.406: C20.1 28.59,13.34 27.74,14.19 26.29,15.65 C18.1 | U1.12 30.26,18 30.64,18.39 30.64,20.97 30.32,21.29 28.18,21.29 U1.7
  Top 0.61: C20.1 28.59,12.05 U3.5
AGND  (via drill 0.43, 0.64, 0.64 pad 0.64, 0.76)
  Top 0.254: JP8.1 6.77,30.65 v6.77,30.97 | v33.48,6.09 32.36,6.09 32.14,5.84 27.74,5.84 27.39,6.19
  Top 0.305: C23.2 C18.2 26.71,18.65 U1.11 29.62,18.65 29.68,18.71 29.68,19.03 | C23.2 | C29.1 24.19,23.87 24.19,24.19 23.67,24.72 C28.1 | C28.1 23.87,24.63 | C31.2 24.89,20.8 C21.2 25.32,20.9 C19.2 26.49,20.6 U1.8 29.4,20.6 v29.68,20.32 | C23.2 24.53,18.39 C30.2 | C28.1 | v22.58,24.84 C28.1 | v25.16,10.65 U3.2 | JP7.1 6.15,23.33 v6.35,23.29 | U1.23 32.22,21.9 32.08,21.76 | D2.3 34.69,38.16 v34.64,38.22
  Top 0.381: C9.1 v12.01,16.13 v12.02,16.13 | C12.2 13.25,16.8 v13.41,17.36 | v13.23,13.55 13.25,13.57 C11.2 13.25,15.78 13.23,15.81 | v17.1,12.58 17.32,12.35 U2.20 18.55,13.06 v17.74,14.19 | U2.17 17.54,10.45 v17.1,10 | U2.9 14.58,7.27 v14.6,7.26 | U2.6 14.5,9.18 v14.52,9.19
  Top 0.4: U1.23 37.23,21.9 arc90 C15.2 C16.2 arc54 v39.44,22.47 | R14.1 v32.23,16.97
  Top 0.406: C13.2 C14.2 v23.31,6.85 | C38.2 JP2.9 | U1.14 28.14,15.7 v28.58,15.26
  Top 0.508: U4.2 29.93,4.12 C35.1
  Top 0.61: v30.32,30.97 C26.1 C27.1 v32.26,30.97 | v32.26,30.97 | R11.2 v28.06,30.64 v28.06,30.65 | C32.2 v25.9,31.71 | C30.2 v23.87,17.26 | C31.2 v23.87,22.1 | v23.87,22.1 | v25.48,13.23 26.13,12.9 26.77,12.9 | 26.77,12.9 C20.2 | 26.77,12.9 26.45,12.9 | R13.1 19.03,27.46 v18.39,28.71 | C36.1 27.66,2.26 | C40.2 v14.52,30.16 | C42.2 v16.45,30.16 | C43.1 v12.26,19.84 | C44.1 v13.55,19.84
  Bottom 0.305: JP7.1 5.81,23.23 | 5.81,23.23
  Bottom 0.406: 30.97,18.71 29.68,18.71
  Bottom 1.016: 30.97,18.71 30.97,22.58
  other vias: 29.68,18.87 20.89,3.63 17.58,3.47 22.74,3.39 24.27,3.23 9.19,5.73 7.66,6.53 7.58,7.98 5.81,8.06 4.78,17.04 12.01,17.37 8.97,2.05 14.35,4.44 14.44,2.26 17.18,7.5 17.18,5.4 32.1,10.81 30.08,12.5 25.4,14.52 16.77,15.81 16.77,17.42 15.16,17.74 15.16,19.35 8.71,30.97 10.97,30.97 12.9,30.81 8.08,23.39 10.51,22.99 1.94,20.65 1.94,18.71 3.87,18.71 3.86,20.59 1.61,6.45 3.55,6.45 5.81,6.45 1.94,9.35 1.94,15.16 20.32,26.45 18.71,34.52 24.19,33.55 25.81,33.55 32.11,21.89 32.01,19.79 28.59,2.06 27.39,6.29 6.83,15.72 5,15.76 31.45,32.58 32.84,32.13
  pour Bottom (isolate 0.127, rank 2, no thermals): -2.58,31.61 -2.31,42.25 15.53,44.32 19.32,44.17 45.24,41.66 45.16,0.32 44.52,0 -1.94,0 -3.23,1.29
  pour Top (isolate 0.508, rank 2, no thermals): 2.26,41.29 44.84,41.29 45.48,40.32 45.16,0 0,0 0,40
GAIN
  Top 0.305: JP2.7 39.07,8.22 R15.1
HILO
  Top 0.203: U2.13 19.51,7.91 19.76,7.66 22.9,7.66 24.27,7.66 24.52,7.42 26.77,7.42 27.42,7.42 28.39,6.45 28.55,6.29 31.61,6.29 31.61,7.9 32.02,8.31 35.08,8.31 36.53,9.6 | 36.53,9.6 36.45,9.6 | 36.45,9.6 | 36.53,9.6 36.45,9.6 | 36.53,9.6 | 36.53,9.6 42.37,9.6 JP2.8
N$1
  Top 0.305: 22.73,19.95 23.87,19.95 | U1.9 23.87,19.95 | 23.87,19.95 C31.1 | 22.73,19.95 21.67,19.95 R1.1 R3.2 21.15,20.24 R8.2 | 22.73,19.95 22.73,20.31 R7.2
N$2
  Top 0.61: JP4.1 22.63,36.13 R13.2
N$3
  Top 0.381: C1.2 23.1,14.66
  Top 1.016: R3.1 21.25,16.52 23.1,14.66
N$4
  Top 1.016: R4.1 19.59,15.89 20.56,14.84 20.56,14.18 C2.2
N$5
  Top 0.305: U2.5 11.1,9.81 10.64,9.35 10.64,9.04 C4.2
N$6
  Top 0.381: U2.16 19.17,9.81 arc90 20.64,11.29 20.64,12.57 arc90 C2.1
N$7
  Top 0.305: U2.15 18.68,9.18
  Top 0.381: 18.68,9.18 19.34,9.18 19.64,9.18 arc90 C1.1
N$8
  Top 0.305: U2.7 12.51,8.54 12.34,8.71 11.94,8.71 C4.1
N$9
  Top 0.305: U2.8 11.94,7.91 C3.2
N$10
  Top 0.305: C3.1 10,7.74 9.68,8.06 9.68,9.35 10.32,10 10.32,10.17 R10.2 11.26,10.45 U2.4
N$11
  Top 0.381: U2.11 18.55,4.84 C5.1 C6.1
N$12
  Top 0.305: 21.4,5.81 C7.1
  Top 0.381: U2.12 19.34,7.27 19.52,7.1 19.52,6.29 20,5.81 21.4,5.81
  Top 0.406: C7.1 C8.1 24.17,5.69 R9.1
N$13
  Top 0.381: U2.1 12.49,12.35 12.26,12.58 12.26,13.87 C9.2
N$14
  Top 0.305: JP3.1 7.52,11.79 7.82,12.1 9.17,12.1 C10.2
N$15
  Top 0.305: JP3.2 9.14,10.69 R10.1
N$16
  Top 0.305: U2.2 11.25,11.72 C10.1
  Top 0.61: C33.1 C48.1
  Top 1.016: C33.1 C10.1
N$17
  Top 0.381: U3.4 30.34,9.7 C17.2
N$18
  Top 0.305: D2.1 35.62,38.84 36.14,39.35
  Top 1.016: R19.2 36.14,39.35 40.32,39.35 41.29,38.71 JP1.1
N$19
  Top 1.016: 4.19,12.26 L4.1
  Top 1.27: X1.1 4.19,12.26
N$20
  Top 0.305: C13.1 20.49,8.54
  Top 0.381: 20.49,8.54 U2.14
  Top 0.406: C13.1 C14.1 23.16,8.32 L3.2
  Top 0.508: L3.2 24.63,8.27 C47.1
N$21
  Top 0.406: U3.3 27.74,9.7 27.74,9.68
  Top 0.61: 27.74,8.71 27.74,9.68 27.74,11.29 27.42,11.61 26.46,11.61 U3.1
  Top 0.813: C22.1 | C22.1 28.06,8.39 27.74,8.71 | L2.2 29.03,7.1 28.39,7.74 28.39,8.18 C22.1
N$23
  Top 0.381: U1.5 29.65,22.55 30.32,23.23 30.32,26.33 C24.1
  Top 0.61: C26.2 30.32,28.06 C25.1 30.44,27.54 C24.1
N$24
  Top 0.813: L5.1 C41.1
N$25
  Top 0.381: U1.6 30.29,21.9 31.94,23.55 31.94,26.25 C24.2
  Top 0.61: C24.2 32.14,27.54 C25.2 32.26,28.06 C27.2
N$26
  Top 0.305: 22.9,19.3 20.3,19.3 R4.2 19.05,19.37 18.71,19.03 R6.1 | 22.9,19.3 23.87,19.3 | 23.87,19.3 U1.10 | 23.87,19.3 C30.1 | R5.1 22.74,19.14 22.9,19.3
N$27
  Top 0.305: U1.4 26.16,23.2 C29.2 25.81,24.39 C28.2 25.37,26.25 24.84,26.77 24.8,26.77 R13.3
N$28
  Top 0.305: U1.3 27.12,23.85 26.77,24.19 26.45,24.52 26.45,26.13 27.1,26.77 27.1,31.61 | C32.1 27.09,29.35 27.1,31.61 | 27.1,31.61 27.1,33.59 JP4.2
N$29
  Top 0.305: U1.2 27.44,24.5 27.1,24.84 27.1,25.81 27.42,26.13 27.74,26.13 28.06,26.45 28.06,27.14 R12.1 28.06,27.38 R11.1
N$30
  Top 0.61: L5.2 11.45,27.26 arc-30 T1.6
N$31  (via drill 0.43)
  Top 0.381: X2.G@4 4.1,23.92 JP6.2 | X2.G@3 1.94,30.91 v1.94,30 | JP5.2 3.55,30.65 v3.55,30 | X2.G@4 2.11,24.52 | 2.11,24.84 X2.G@4
  Top 0.813: T1.4 10.64,24.84 v3.55,24.84 2.11,24.84 2.11,24.52 X2.G@4
  Top 1.016: 2.11,24.84 X2.G@4 3.55,23.92 v3.55,24.84
  Bottom 0.381: 2.11,30.65 JP5.2 | X2.G@3 2.11,30.65 | 2.11,30.65 JP5.2 | X2.G@3 2.11,30.65 | 2.11,30.65 JP5.2 | X2.G@3 2.11,30.65 | JP6.2 2.11,23.23 X2.G@4 | v1.94,30 4.18,30 JP5.2 | X2.G@4 2.11,24.52 | X2.G@4 2.9,23.92 2.9,24.84 v3.55,24.84 | X2.G@4 3.87,23.92 3.87,24.84
  Bottom 1.016: X2.G@4 2.11,24.84 X2.G@4 | X2.G@4 1.94,23.92 1.94,26.45
  other vias: 1.94,24.84
  pour Bottom (no thermals): 5.16,29.68 11.61,29.68 13.87,28.71 13.55,27.1 11.94,23.55 10.32,24.52 0.32,24.52 0.32,29.68
N$32
  Top 0.61: 17.42,25.15 R17.2
  Top 0.813: T1.1 17.42,25.15 19.35,24.52 arc-73 R1.2
N$33
  Top 0.508: C34.1 34.5,3.38 34.28,3.16 32.9,3.16 U4.4
N$34
  Top 0.508: U4.6 34.3,5.07 C34.2
N$35
  Top 0.381: U2.3 14.31,11.08 14.52,11.29 | U2.19 15.91,11.72 15.81,11.61 | U2.18 15.92,11.08 15.81,10.97
  Top 0.508: L1.2 25.99,3.46 25.98,3.46 25.98,3.36 | C37.1 26.13,2.46 C46.2
  Top 0.61: C12.1 14.55,15.16 C11.1 14.52,14.54 14.52,11.29
  Top 0.762: 16.36,2.03 24.65,2.03 25.08,2.06 25.74,2.06 C37.1 | 25.98,3.36 25.98,2.61 C46.2
  Top 0.813: 16.36,2.03 15.81,2.58 15.81,10.97 15.81,11.61 15.81,13.9 14.55,15.16
N$36
  Top 0.305: R16.1 12.9,1.61 13.55,0.97 13.87,0.65 40.97,0.65 42.58,2.26 42.58,4.19 42.42,4.35 38.47,4.35 37.26,5.56 37.26,6.41 C38.1 R15.2
N$37
  Top 0.305: U2.10 12.9,6.49 R16.2 12.89,4.07 | C39.1 12.89,4.07 | D3.3 12.85,4.11 12.89,4.07
N$38
  Top 0.61: 16.31,22.75 R18.1
  Top 0.813: T1.3 16.31,22.75 19.35,21.61 arc-91 R2.2
N$39
  Top 0.61: C43.2 12.5,22.34 | C44.2 13.27,22.05 12.88,22.2 | 15.65,27.66 C42.1 | 14.59,28.04 C40.1
  Top 0.813: 13.55,25.16 T1.2 | 13.55,25.16 12.5,22.34 12.88,22.2 R18.2 | R17.1 15.65,27.66 14.6,28.06 14.59,28.04 13.55,25.16
N$40
  Top 1.016: X3.1 15.16,36.45 15.99,36.99 | 15.99,36.99 19.68,39.35 R19.1 | R22.2 16.13,36.85 15.99,36.99
N$41
  Bottom 0.381: R20.1 JP9.1
N$42
  Top 0.381: R21.1 6.45,40.97 JP9.2
N$43
  Top 0.813: X2.1 C41.2
N$44
  Top 0.305: D1.1 34.27,35.53 33.85,35.98 33.85,37.88 33.46,38.23 20.9,38.23 20.67,38.46 20.67,40.94 20.64,40.97
  Top 0.381: R21.2 20.64,40.97 41.29,40.97 JP1.2
N$45
  Top 0.508: U4.5 31.94,4.12 31.89,4.06 31.89,3.16 | 31.89,3.16 31.89,2.26 C36.2 32.19,1.76 L6.1 | U4.3 31.68,3.17 31.89,3.16
  Top 0.813: 32,1.96 C36.2
N$46
  Top 0.813: C33.2 L4.2

### Text on the board
tPlace: ADC Fullscale | POS | ADJ | FIX | 1 | GND | TRIG | CLOCK | TC1-1T | JP3 | AD9215 | AD8331
bPlace: TRIGGER_IN | CLOCK_IN | ADC_OR | ADC9 | ADC8 | ADC7 | ADC6 | ADC5 | 3.3V Only | GND | VCC | ADC4 | ADC3 | ADC2 | ADC1 | ADC0 | CLOCK | GAINMODE | GAIN | S/N: | GND | Pb-Free | VCC | RoHS | Revision 28NOV2012 | www.newae.com/openadc
NotesToFab: Board Stackup | TOP SILKSCREEN | TOP SOLDERMASK | TOP COPPER (1 Oz) | FR4 Material (0.062") | BOTTOM COPPER (1 Oz) | BOTTOM SILKSCREEN | (A) | PCB Fab: Place any required markings in location (A) top/bottom layer